# EAGLE design Probe Board 1.0 (EAGLE 9.3.0)

## Sheet 1 of 3: ADC Schematic
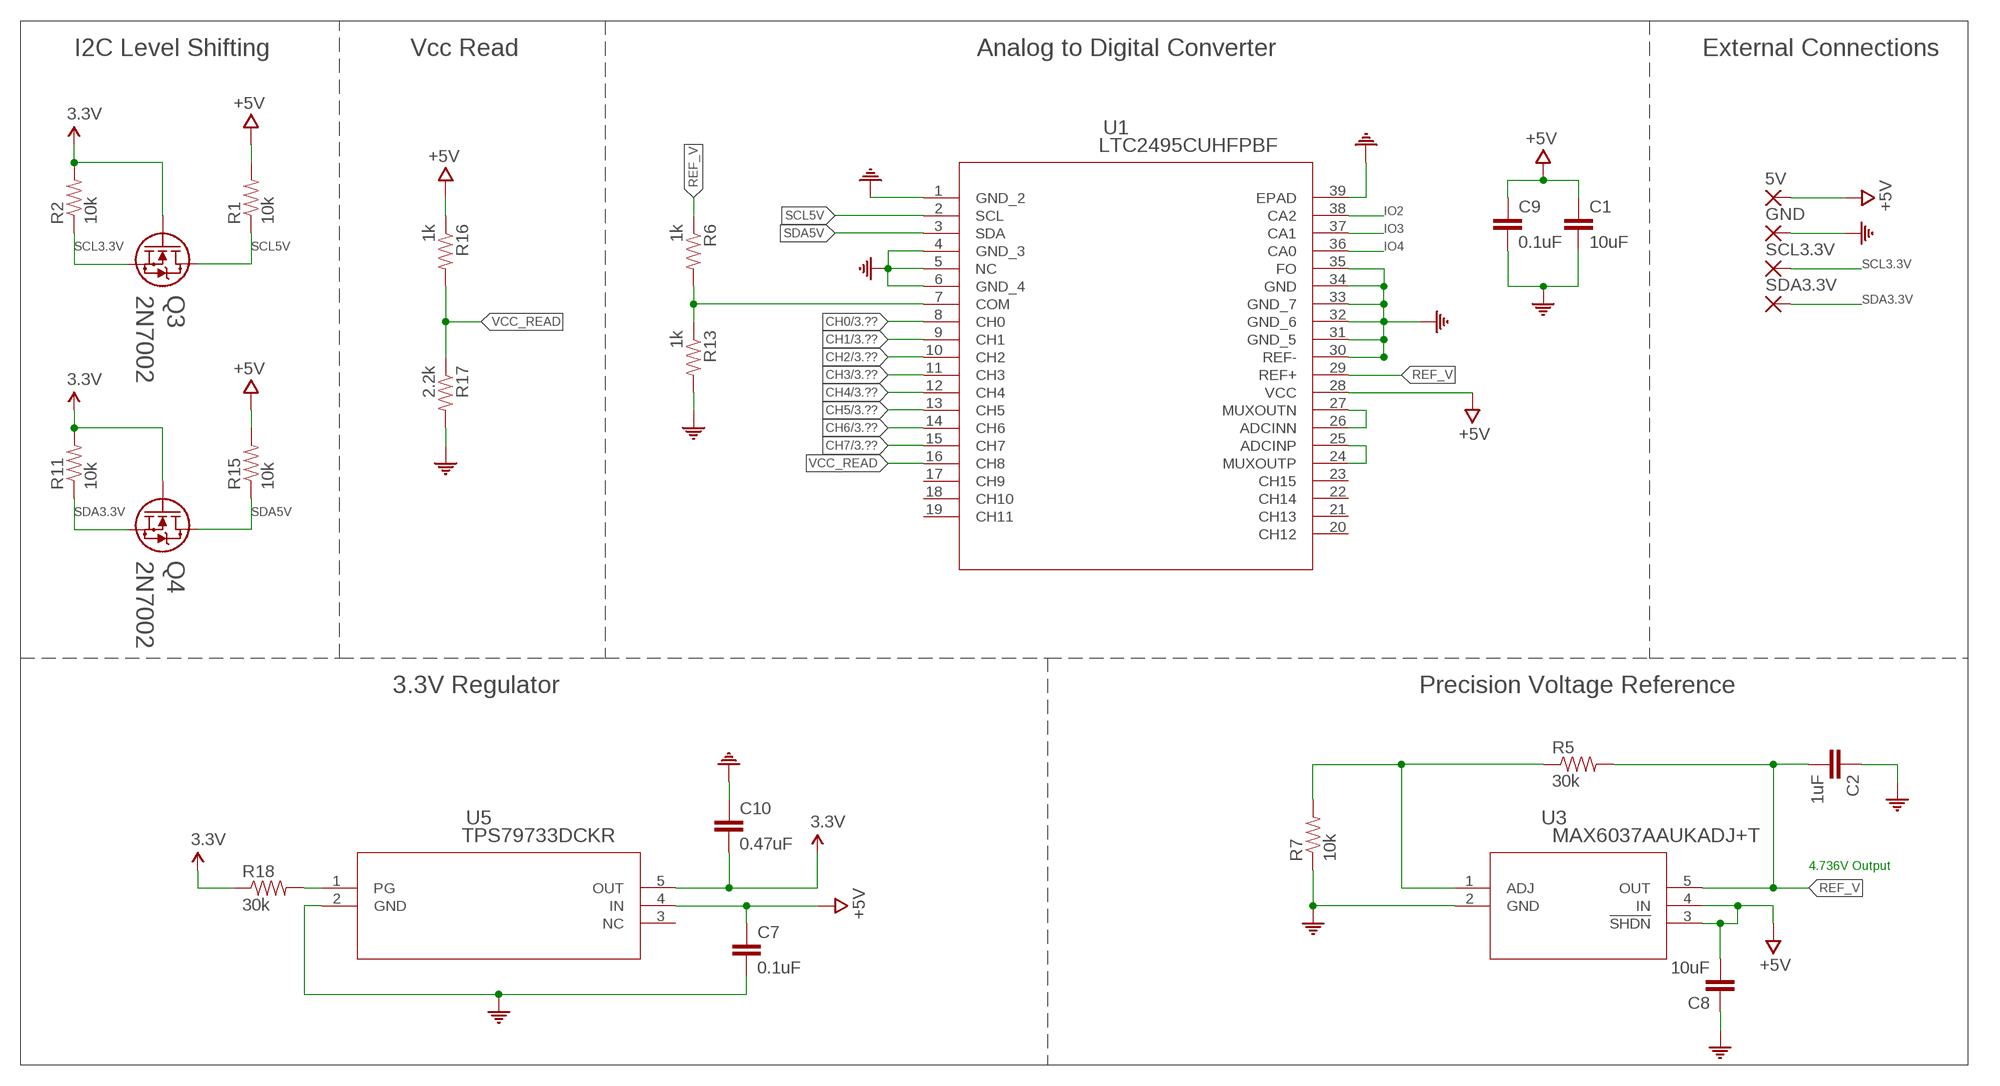
[diagram p0: schematic, sheet 1]

### Parts
5V  1,6/0,9  [1,6/0,9]
C1  10uF  CAP0603-CAP  [0603-CAP]
C2  1uF  CAP0603-CAP  [0603-CAP]
C7  0.1uF  CAP0603-CAP  [0603-CAP]
C8  10uF  CAP0603-CAP  [0603-CAP]
C9  0.1uF  CAP0603-CAP  [0603-CAP]
C10  0.47uF  CAP0603-CAP  [0603-CAP]
GND  1,6/0,9  [1,6/0,9]
Q3  2N7002  [SOT23-3L]
Q4  2N7002  [SOT23-3L]
R1  10k  RESISTOR0603-RES  [0603-RES]
R2  10k  RESISTOR0603-RES  [0603-RES]
R5  30k  RESISTOR0603-RES  [0603-RES]
R6  1k  RESISTOR0603-RES  [0603-RES]
R7  10k  RESISTOR0603-RES  [0603-RES]
R11  10k  RESISTOR0603-RES  [0603-RES]
R13  1k  RESISTOR0603-RES  [0603-RES]
R15  10k  RESISTOR0603-RES  [0603-RES]
R16  1k  RESISTOR0603-RES  [0603-RES]
R17  2.2k  RESISTOR0603-RES  [0603-RES]
R18  30k  RESISTOR0603-RES  [0603-RES]
SCL3.3V  1,6/0,9  [1,6/0,9]
SDA3.3V  1,6/0,9  [1,6/0,9]
U1  LTC2495CUHFPBF  [QFN-38_UHF]
U3  MAX6037AAUKADJ+T  [21-0057F]
U5  TPS79733DCKR  [DCK5]

### Nets
3.3V: C10.2 Q3.1 Q4.1 R2.2 R11.2 R18.1 U5.5(OUT)
+5V: 5V.1(P) C1.1 C7.1 C8.2 C9.1 R1.2 R15.2 R16.1 U1.28(VCC) U3.3(!SHDN) U3.4(IN) U5.4(IN) ; also sheet 2,3
CH0: U1.8(CH0) ; also sheet 3
CH1: U1.9(CH1) ; also sheet 3
CH2: U1.10(CH2) ; also sheet 3
CH3: U1.11(CH3) ; also sheet 3
CH4: U1.12(CH4) ; also sheet 3
CH5: U1.13(CH5) ; also sheet 3
CH6: U1.14(CH6) ; also sheet 3
CH7: U1.15(CH7) ; also sheet 3
COM: C1.2 C2.1 C7.2 C8.1 C9.2 C10.1 GND.1(P) R7.1 R13.2 R17.2 U1.1(GND_2) U1.4(GND_3) U1.5(NC) U1.6(GND_4) U1.30(REF-) U1.31(GND_5) U1.32(GND_6) U1.33(GND_7) U1.34(GND) U1.35(FO) U1.39(EPAD) U3.2(GND) U5.2(GND) ; also sheet 2,3
IO2: U1.38(CA2) ; also sheet 2
IO3: U1.37(CA1) ; also sheet 2
IO4: U1.36(CA0) ; also sheet 2
N$2: U1.26(ADCINN) U1.27(MUXOUTN)
N$3: U1.24(MUXOUTP) U1.25(ADCINP)
N$5: R6.2 R13.1 U1.7(COM)
N$6: R5.1 R7.2 U3.1(ADJ)
N$9: R18.2 U5.1(PG)
REF_V: C2.2 R5.2 R6.1 U1.29(REF+) U3.5(OUT)
SCL3.3V: Q3.2 R2.1 SCL3.3V.1(P)
SCL5V: Q3.5 R1.1 U1.2(SCL)
SDA3.3V: Q4.2 R11.1 SDA3.3V.1(P)
SDA5V: Q4.5 R15.1 U1.3(SDA)
VCC_READ: R16.2 R17.1 U1.16(CH8)
Unconnected: U1.17(CH9) U1.18(CH10) U1.19(CH11) U1.20(CH12) U1.21(CH13) U1.22(CH14) U1.23(CH15) U5.3(NC)

### Notes on the sheet
- I2C Level Shifting | Vcc Read | Analog to Digital Converter | External Connections
- 3.3V Regulator | Precision Voltage Reference
- 4.736V Output

## Sheet 2 of 3: Arduino Schematic
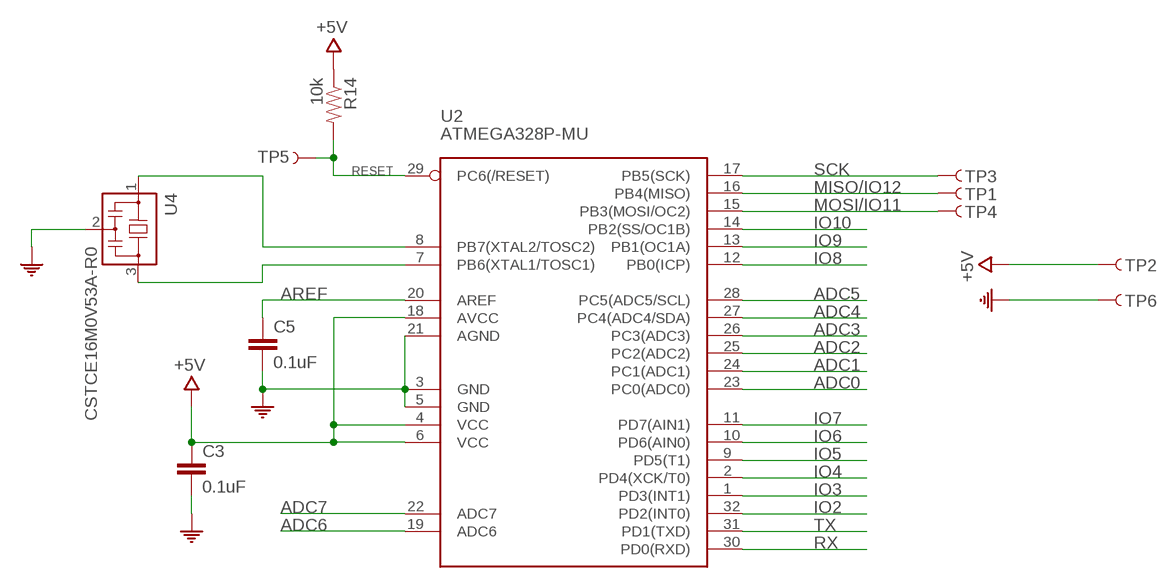
[diagram p1: schematic, sheet 2]

### Parts
C3  0.1uF  CAP0603-CAP  [0603-CAP]
C5  0.1uF  CAP0603-CAP  [0603-CAP]
R14  10k  RESISTOR0603-RES  [0603-RES]
TP1  TEST-POINT3  [PAD.03X.03]
TP2  TEST-POINT3  [PAD.03X.03]
TP3  TEST-POINT3  [PAD.03X.03]
TP4  TEST-POINT3  [PAD.03X.03]
TP5  TEST-POINT3  [PAD.03X.03]
TP6  TEST-POINT3  [PAD.03X.03]
U2  ATMEGA328P-MU  ATMEGAXX8-MUR  [MLF32]
U4  CSTCE16M0V53A-R0  [CSTCE_V]

### Nets
+5V: C3.1 R14.1 TP2.P$1 U2.4(VCC) U2.6(VCC) U2.18(AVCC) ; also sheet 1,3
ADC0: U2.23(PC0(ADC0))
ADC1: U2.24(PC1(ADC1))
ADC2: U2.25(PC2(ADC2))
ADC3: U2.26(PC3(ADC3))
ADC4: U2.27(PC4(ADC4/SDA))
ADC5: U2.28(PC5(ADC5/SCL))
ADC6: U2.19(ADC6)
ADC7: U2.22(ADC7)
AREF: C5.1 U2.20(AREF)
COM: C3.2 C5.2 TP6.P$1 U2.3(GND) U2.5(GND) U2.21(AGND) U4.2 ; also sheet 1,3
IO2: U2.32(PD2(INT0)) ; also sheet 1
IO3: U2.1(PD3(INT1)) ; also sheet 1
IO4: U2.2(PD4(XCK/T0)) ; also sheet 1
IO5: U2.9(PD5(T1))
IO6: U2.10(PD6(AIN0))
IO7: U2.11(PD7(AIN1))
IO8: U2.12(PB0(ICP))
IO9: U2.13(PB1(OC1A))
IO10: U2.14(PB2(SS/OC1B))
MISO/IO12: TP1.P$1 U2.16(PB4(MISO))
MOSI/IO11: TP4.P$1 U2.15(PB3(MOSI/OC2))
N$1: U2.8(PB7(XTAL2/TOSC2)) U4.1
N$7: U2.7(PB6(XTAL1/TOSC1)) U4.3
RESET: R14.2 TP5.P$1 U2.29(PC6(/RESET))
RX: U2.30(PD0(RXD))
SCK: TP3.P$1 U2.17(PB5(SCK))
TX: U2.31(PD1(TXD))

## Sheet 3 of 3: Thermistor Connections
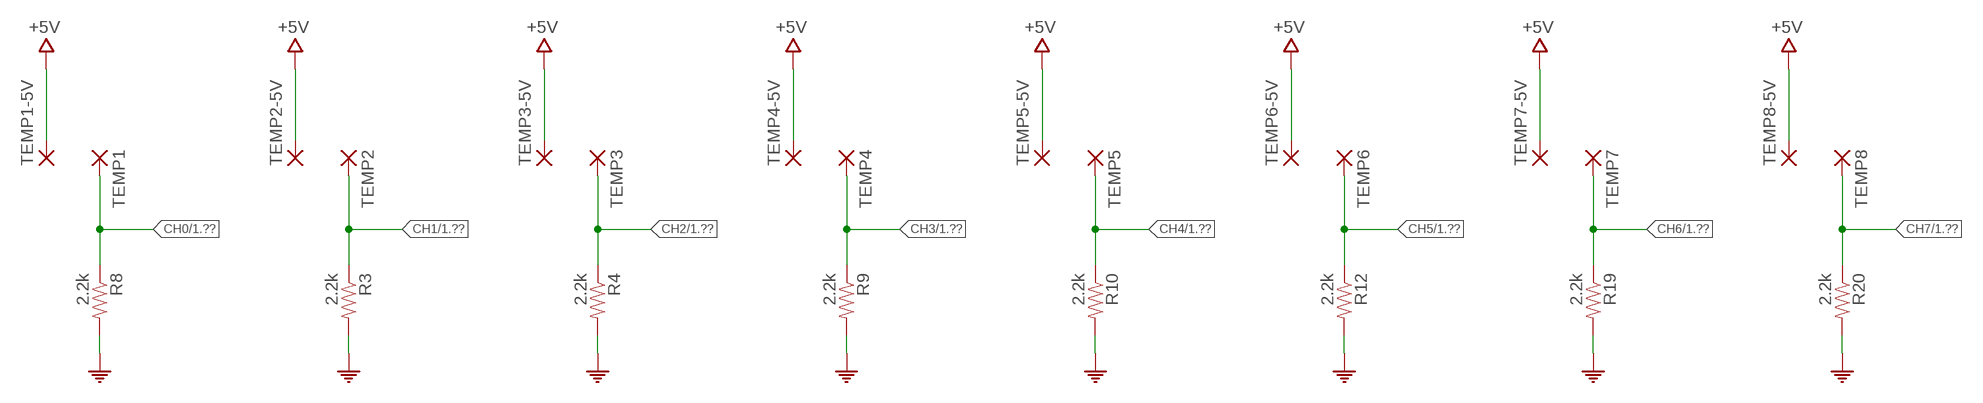
[diagram p2: schematic, sheet 3]

### Parts
R3  2.2k  RESISTOR0603-RES  [0603-RES]
R4  2.2k  RESISTOR0603-RES  [0603-RES]
R8  2.2k  RESISTOR0603-RES  [0603-RES]
R9  2.2k  RESISTOR0603-RES  [0603-RES]
R10  2.2k  RESISTOR0603-RES  [0603-RES]
R12  2.2k  RESISTOR0603-RES  [0603-RES]
R19  2.2k  RESISTOR0603-RES  [0603-RES]
R20  2.2k  RESISTOR0603-RES  [0603-RES]
TEMP1  1,6/0,9  [1,6/0,9]
TEMP1-5V  1,6/0,9  [1,6/0,9]
TEMP2  1,6/0,9  [1,6/0,9]
TEMP2-5V  1,6/0,9  [1,6/0,9]
TEMP3  1,6/0,9  [1,6/0,9]
TEMP3-5V  1,6/0,9  [1,6/0,9]
TEMP4  1,6/0,9  [1,6/0,9]
TEMP4-5V  1,6/0,9  [1,6/0,9]
TEMP5  1,6/0,9  [1,6/0,9]
TEMP5-5V  1,6/0,9  [1,6/0,9]
TEMP6  1,6/0,9  [1,6/0,9]
TEMP6-5V  1,6/0,9  [1,6/0,9]
TEMP7  1,6/0,9  [1,6/0,9]
TEMP7-5V  1,6/0,9  [1,6/0,9]
TEMP8  1,6/0,9  [1,6/0,9]
TEMP8-5V  1,6/0,9  [1,6/0,9]

### Nets
+5V: TEMP1-5V.1(P) TEMP2-5V.1(P) TEMP3-5V.1(P) TEMP4-5V.1(P) TEMP5-5V.1(P) TEMP6-5V.1(P) TEMP7-5V.1(P) TEMP8-5V.1(P) ; also sheet 1,2
CH0: R8.1 TEMP1.1(P) ; also sheet 1
CH1: R3.1 TEMP2.1(P) ; also sheet 1
CH2: R4.1 TEMP3.1(P) ; also sheet 1
CH3: R9.1 TEMP4.1(P) ; also sheet 1
CH4: R10.1 TEMP5.1(P) ; also sheet 1
CH5: R12.1 TEMP6.1(P) ; also sheet 1
CH6: R19.1 TEMP7.1(P) ; also sheet 1
CH7: R20.1 TEMP8.1(P) ; also sheet 1
COM: R3.2 R4.2 R8.2 R9.2 R10.2 R12.2 R19.2 R20.2 ; also sheet 1,2

## Library data of the parts
5V GND SCL3.3V SDA3.3V TEMP1 TEMP1-5V TEMP2 TEMP2-5V TEMP3 TEMP3-5V TEMP4 TEMP4-5V TEMP5 TEMP5-5V TEMP6 TEMP6-5V TEMP7 TEMP7-5V TEMP8 TEMP8-5V = wirepad:1,6/0,9: THROUGH-HOLE PAD
C1 C8 = SparkFun:CAP: Capacitor Standard 0603 ceramic capacitor, and 0.1" leaded capacitor.; DIGIKEY_PART_NUMBER: 445-9104-6-ND; MANUFACTURER: TDK Corporation; MANUFACTURER_PART_NUMBER: C1608X7S0J106M080AC; PRICE: 0.18328
C2 = SparkFun:CAP: Capacitor Standard 0603 ceramic capacitor, and 0.1" leaded capacitor.; DIGIKEY_PART_NUMBER: 1276-1184-6-ND; MANUFACTURER: Samsung Electro-Mechanics; MANUFACTURER_PART_NUMBER: CL10B105KA8NNNC; PRICE: 0.01719
C3 C5 C7 C9 = SparkFun:CAP: Capacitor Standard 0603 ceramic capacitor, and 0.1" leaded capacitor.; DIGIKEY_PART_NUMBER: 478-7939-2-ND; MANUFACTURER: AVX Corporation; MANUFACTURER_PART_NUMBER: 0603ZC104KAT2A; PRICE: 0.08325
C10 = SparkFun:CAP: Capacitor Standard 0603 ceramic capacitor, and 0.1" leaded capacitor.; DIGIKEY_PART_NUMBER: 478-10367-1-ND; MANUFACTURER: AVX Corporation; MANUFACTURER_PART_NUMBER: 0603ZC474KAT2A; PRICE: 0.02904
Q3 = 2N7002(2):2N7002; DIGIKEY_PART_NUMBER: 2N7002NCT-ND; MANUFACTURER: ON Semiconductor; MANUFACTURER_PART_NUMBER: 2N7002; PRICE: 0.06193; VENDOR: ON Semiconductor
Q4 = 2N7002(2):2N7002; DIGIKEY_PART_NUMBER: 2N7002NCT-ND; MANUFACTURER: ON Semiconductor; MANUFACTURER_PART_NUMBER: 2N7002; PRICE: 0.06193; VENDOR: STMicroelectronics
R1 R2 R7 R11 R14 R15 = SparkFun:RESISTOR: Resistor Basic schematic elements and footprints for 0603, 1206, and PTH resistors.; DIGIKEY_PART_NUMBER: P10KGTR-ND; MANUFACTURER: Panasonic Electronic Components; MANUFACTURER_PART_NUMBER: ERJ-3GEYJ103V; PRICE: 0.00494
R3 R4 R8-R10 R12 R17 R19 R20 = SparkFun:RESISTOR: Resistor Basic schematic elements and footprints for 0603, 1206, and PTH resistors.; DIGIKEY_PART_NUMBER: P2.2KDBTR-ND; MANUFACTURER: Panasonic Electronic Components; MANUFACTURER_PART_NUMBER: ERA-3AEB222V; PRICE: 0.03717
R5 R18 = SparkFun:RESISTOR: Resistor Basic schematic elements and footprints for 0603, 1206, and PTH resistors.; DIGIKEY_PART_NUMBER: P30KGDKR-ND; MANUFACTURER: Panasonic Electronic Components; MANUFACTURER_PART_NUMBER: ERJ-3GEYJ303V; PRICE: 0.00758
R6 R13 R16 = SparkFun:RESISTOR: Resistor Basic schematic elements and footprints for 0603, 1206, and PTH resistors.; DIGIKEY_PART_NUMBER: P1.0KDBDKR-ND; MANUFACTURER: Panasonic Electronic Components; MANUFACTURER_PART_NUMBER: ERA-3AEB102V; PRICE: 0.04906
TP1-TP6 = SparkFun-Passives:TEST-POINT: Bare copper test points for troubleshooting or ICT
U1 = LTC2495:LTC2495CUHFPBF; DIGIKEY_PART_NUMBER: LTC2495IUHF#PBF-ND; MANUFACTURER: Linear Technology/Analog Devices; MANUFACTURER_PART_NUMBER: LTC2495CUHF#PBF; PRICE: 5.11040; VENDOR: Linear Technology
U2 = Smartprj:ATMEGAXX8: MICROCONTROLLER 8 Kbytes FLASH 1 kbytes SRAM 512 bytes EEPROM USART 6-channel 10 bit ADC 2-channel 8 bit ADC Source: avr.lbr; DIGIKEY_PART_NUMBER: ATMEGA328P-MU-ND; MANUFACTURER: Microchip Technology; MANUFACTURER_PART_NUMBER: ATMEGA328P-MU; PRICE: 1.95040
U3 = MAX6037AAUKADJ:MAX6037AAUKADJ+T; DIGIKEY_PART_NUMBER: MAX6037AAUK33+TCT-ND; MANUFACTURER: Maxim Integrated; MANUFACTURER_PART_NUMBER: MAX6037AAUK33+T; PRICE: 2.59488; VENDOR: Maxim Integrated Products
U4 = Murata Resonator:CSTCE16M0V53A-R0; DIGIKEY_PART_NUMBER: 490-1198-1-ND; MANUFACTURER: Murata Electronics North America; MANUFACTURER_PART_NUMBER: CSTCE16M0V53-R0; PRICE: 0.26858; VENDOR: Murata
U5 = TPS79733:TPS79733DCKR; DIGIKEY_PART_NUMBER: 296-11990-6-ND; MANUFACTURER: Texas Instruments; MANUFACTURER_PART_NUMBER: TPS79733DCKR; PRICE: 0.46196; VENDOR: Texas Instruments

## Net classes
0 default: width 0.203 mm

## Board
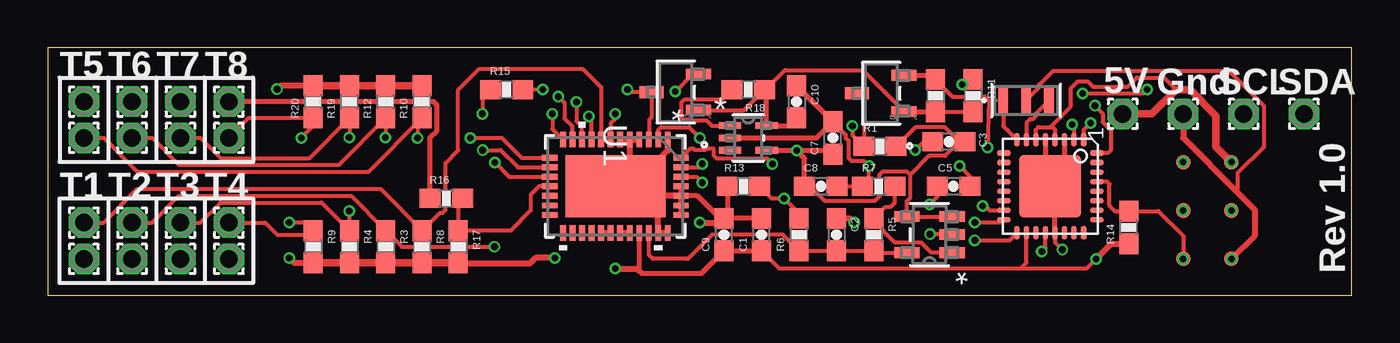
[diagram p3: board, top side]
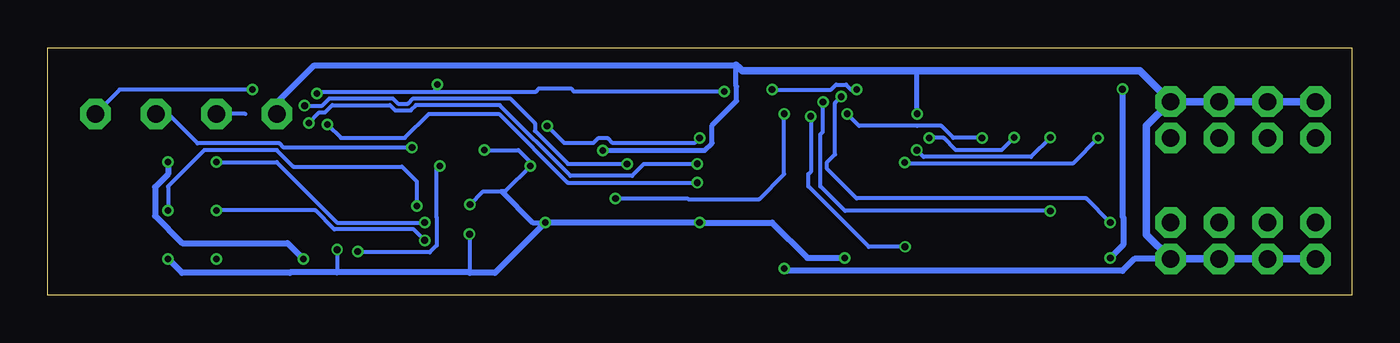
[diagram p4: board, bottom side, seen from below]

Size 68.56 x 13.01 mm. Coordinates in mm from the lower left corner, seen from the top.
Outline: 0,0 68.56,0 68.56,13.01 0,13.01 0,0
Copper layers (1*16): Top 0.035559375mm / dielectric 1.6mm / Bottom 0.035559375mm
Design rules "oshpark-2layer": minimum track width 6mil, minimum drill 10mil, track to track 6mil, track to pad 6mil, pad to pad 6mil, via to via 6mil, smd to smd 6mil, copper to edge 15mil, drill to drill 6mil, minimum pad ring 5mil, minimum via ring 5mil, stop-mask expansion 2.5mil, vias tented up to drill 0mil, thermal gap 10mil

### Footprints (pad centres in the part's own frame; a part is rotated, then mirrored left to right if it is on the bottom)
1,6/0,9 = drill 0.914 pad 1.6 octagon: 1 0,0
0603-CAP = smd 1.1 x 1: 1 -0.85,0; 2 0.85,0
SOT23-3L = smd 0.559 x 1.321: 1 -0.95,-1.194; 2 0.95,-1.194 | smd 0 x 0 bottom: 3 0,1.194 | smd 0.635 x 1.27: 5 0,1.27
0603-RES = smd 1.1 x 1: 1 -0.85,0; 2 0.85,0
PAD.03X.03 = smd 0.762 x 0.762: P$1 0,0
QFN-38_UHF = smd 0.805 x 0.3: 1 -2.452,2.75; 2 -2.452,2.25; 3 -2.452,1.75; 4 -2.452,1.25; 5 -2.452,0.75; 6 -2.452,0.25; 7 -2.452,-0.25; 8 -2.452,-0.75; 9 -2.452,-1.25; 10 -2.452,-1.75; 11 -2.452,-2.25; 12 -2.452,-2.75; 20 2.452,-2.75; 21 2.452,-2.25; 22 2.452,-1.75; 23 2.452,-1.25; 24 2.452,-0.75; 25 2.452,-0.25; 26 2.452,0.25; 27 2.452,0.75; 28 2.452,1.25; 29 2.452,1.75; 30 2.452,2.25; 31 2.452,2.75 | smd 0.3 x 0.805: 13 -1.5,-3.452; 14 -1,-3.452; 15 -0.5,-3.452; 16 0,-3.452; 17 0.5,-3.452; 18 1,-3.452; 19 1.5,-3.452; 32 1.5,3.452; 33 1,3.452; 34 0.5,3.452; 35 0,3.452; 36 -0.5,3.452; 37 -1,3.452; 38 -1.5,3.452 | smd 3.25 x 5.25: 39 0,0
MLF32 = smd 0.7 x 0.28: 1 -2.45,1.75; 2 -2.45,1.25; 3 -2.45,0.75; 4 -2.45,0.25; 5 -2.45,-0.25; 6 -2.45,-0.75; 7 -2.45,-1.25; 8 -2.45,-1.75; 17 2.45,-1.75; 18 2.45,-1.25; 19 2.45,-0.75; 20 2.45,-0.25; 21 2.45,0.25; 22 2.45,0.75; 23 2.45,1.25; 24 2.45,1.75 | smd 0.28 x 0.7: 9 -1.75,-2.45; 10 -1.25,-2.45; 11 -0.75,-2.45; 12 -0.25,-2.45; 13 0.25,-2.45; 14 0.75,-2.45; 15 1.25,-2.45; 16 1.75,-2.45; 25 1.75,2.45; 26 1.25,2.45; 27 0.75,2.45; 28 0.25,2.45; 29 -0.25,2.45; 30 -0.75,2.45; 31 -1.25,2.45; 32 -1.75,2.45 | smd 3.254 x 3.254: 33 0,0
21-0057F = smd 1.321 x 0.559: 1 -1.194,0.95; 2 -1.194,0; 3 -1.194,-0.95; 4 1.194,-0.95; 5 1.194,0.95
CSTCE_V = smd 0.508 x 1.448: 1 -1.2,0; 2 0,0; 3 1.2,0
DCK5 = smd 1.168 x 0.356: 1 -0.965,0.65; 2 -0.965,0; 3 -0.965,-0.65; 4 0.965,-0.65; 5 0.965,0.65

### Placement (x,y rotation side)
5V  56.52,9.53 0 top
C1  37.53,3.17 90 top
C2  41.47,3.17 270 top
C3  47.37,8.06 180 top
C5  47.62,5.71 180 top
C7  41.27,8.26 90 top
C8  40.64,5.71 180 top
C9  35.56,3.17 90 top
C10  39.37,10.16 270 top
GND  59.69,9.53 0 top
Q3  43.81,10.6 90 top
Q4  33.02,10.67 90 top
R1  43.75,7.81 0 top
R2  46.67,10.48 270 top
R3  17.78,2.54 270 top
R4  15.88,2.54 270 top
R5  43.43,3.17 270 top
R6  39.5,3.17 90 top
R7  43.69,5.71 0 top
R8  19.68,2.54 270 top
R9  13.97,2.54 270 top
R10  19.68,10.16 90 top
R11  48.64,10.48 270 top
R12  17.78,10.16 90 top
R13  36.58,5.71 180 top
R14  56.83,3.56 90 top
R15  24.13,10.79 180 top
R16  20.95,5.08 0 top
R17  21.59,2.54 270 top
R18  36.83,10.79 180 top
R19  15.88,10.16 90 top
R20  13.97,10.16 90 top
SCL3.3V  62.87,9.53 0 top
SDA3.3V  66.04,9.53 0 top
TEMP1  1.91,3.81 0 top
TEMP1-5V  1.91,1.91 0 top
TEMP2  4.45,3.81 0 top
TEMP2-5V  4.45,1.91 0 top
TEMP3  6.99,3.81 0 top
TEMP3-5V  6.99,1.91 0 top
TEMP4  9.53,3.81 0 top
TEMP4-5V  9.53,1.91 0 top
TEMP5  1.91,8.26 0 top
TEMP5-5V  1.91,10.16 0 top
TEMP6  4.45,8.26 0 top
TEMP6-5V  4.45,10.16 0 top
TEMP7  6.99,8.26 0 top
TEMP7-5V  6.99,10.16 0 top
TEMP8  9.53,8.26 0 top
TEMP8-5V  9.53,10.16 0 top
TP1  59.69,6.99 0 top
TP2  62.23,6.99 0 top
TP3  59.69,4.45 0 top
TP4  62.23,4.45 0 top
TP5  59.69,1.91 0 top
TP6  62.23,1.91 0 top
U1  29.84,5.71 270 top
U2  52.7,5.71 270 top
U3  46.35,3.17 180 top
U4  51.44,10.22 0 top
U5  36.83,8.26 0 top

### Tracks (layer width: path | path; a pad name or v marks a point on that pad's centre or on a via)
3.3V
  Top 0.203: Q4.1 36.6,9.72 R18.1 37.75,10.79 38.77,11.81 42.85,11.81 Q3.1 | R2.2 R11.2
  Top 0.254: C10.2 38.97,8.9 U5.5 37.8,10.68 R18.1 | Q3.1 45.04,9.63 R2.2
+5V  (via drill 0.35)
  Top 0.203: 45.34,6.32 45.34,5.11 45.16,4.93 U3.4 U3.3 | 45.34,6.32 45.19,6.47 43.88,6.47 43.73,6.32 43.73,5.2 43.49,4.96 40.84,4.96 40.08,5.71 C8.2 | R15.2 22.86,10.38 v22.86,9.53 | 44.45,7.66 R1.2 45.61,8.82 47.18,8.82 47.93,8.06 | 51.13,1.39 38.46,1.39 C1.1 | 51.13,1.39 51.45,1.71 U2.18 | v55.12,1.91 54.6,1.39 51.13,1.39 | 59.33,10.79 58.69,11.43 57.25,11.43 56.77,10.95 54.95,10.95 54.67,11.23 54.15,11.23 53.78,10.86 53.78,9.9 52.7,8.83 | U2.6 51.95,8.71 52.07,8.83 52.7,8.83 | 52.7,8.83 52.83,8.83 52.96,8.7 52.95,8.7 U2.4 | 45.34,6.32 46.33,7.31 47.18,7.31 47.93,8.06 | C3.1 47.93,8.06
  Top 0.254: R16.1 20.11,8.29 20.46,8.64 20.46,9.98 20.28,10.16 TEMP8-5V.1 | U1.28 31.09,1.29 31.24,1.14 34.38,1.14 C9.1 C1.1 | 41.08,7.61 C7.1 41.08,7.6 v39.37,7.6 | U5.4 v39.36,7.61 v39.37,7.6 | C8.2 39.79,7.18 v39.37,7.6
  Top 0.305: v29.84,1.39 30.99,1.39 31.09,1.29 | v55.12,1.91 55.92,2.71 R14.1
  Top 0.406: TP2.P$1 61.42,7.8 61.42,9.43 60.05,10.79 59.33,10.79 58.06,9.53 5V.1
  Bottom 0.254: v22.86,9.53 22.86,11.79 | 32.38,12.06 32.38,11.01 32.34,10.97 32.34,10.2 33.63,8.91 33.63,7.98 34.02,7.6 v39.37,7.6
  Bottom 0.305: 32.38,12.06 54.55,12.06 56.52,10.1 5V.1 | TEMP4-5V.1 11.43,1.91 12.06,1.27 29.72,1.27 v29.84,1.39 | TP2.P$1 62.23,6.35 62.91,5.67 62.91,4.16 61.48,2.73 55.94,2.73 v55.12,1.91
  Bottom 0.406: TEMP1-5V.1 TEMP2-5V.1 TEMP3-5V.1 TEMP4-5V.1 10.79,3.17 10.79,8.89 TEMP8-5V.1 | TEMP5-5V.1 TEMP6-5V.1 TEMP7-5V.1 TEMP8-5V.1 | 32.38,12.06 32.03,11.79 22.86,11.79 11.15,11.79 TEMP8-5V.1
  other vias: 62.23,6.99
AREF  (via drill 0.35)
  Top 0.203: v47.94,6.79 48.48,6.25 C5.1 | v52.26,2.29 52.45,2.48 U2.20
  Bottom 0.203: v47.94,6.79 48.13,6.59 48.13,4.1 48.11,4.07 48.11,2.62 48.48,2.25 52.22,2.25 v52.26,2.29
CH0
  Top 0.203: TEMP1.1 2.95,3.81 4.72,5.58 17.5,5.58 R8.1 20.62,4.33 20.76,4.33 20.91,4.47 20.91,6.94 21.59,7.62 21.59,10.79 22.68,11.89 28.12,11.89 29.09,10.91 U1.8
CH1  (via drill 0.35)
  Top 0.203: TEMP2.1 5.49,3.81 6.9,5.22 15.95,5.22 R3.1 18.63,2.54 v23.5,2.54 | U1.9 28.59,9.25 v28.45,9.39
  Bottom 0.203: v23.5,2.54 25.4,2.54 28.57,5.71 28.57,6.35 28.45,6.48 v28.45,9.39
CH2  (via drill 0.35)
  Top 0.203: TEMP3.1 8.03,3.81 9.09,4.86 14.4,4.86 R4.1 15.88,4.4 v15.85,4.42 | 28.07,8.2 28.07,8.19 | 28.07,8.19 U1.10 | v27.8,10.15 27.8,9.14 28.07,8.88 28.07,8.19
  Bottom 0.203: v15.85,4.42 26.65,4.42 27.94,5.71 27.94,8.45 27.81,8.57 27.81,10.14 v27.8,10.15
CH3  (via drill 0.35)
  Top 0.203: TEMP4.1 11.43,3.81 12.06,3.17 13.76,3.17 R9.1 13.55,3.81 v12.7,3.81 | U1.11 27.56,8.2 27.56,8.88 27.17,9.27 27.17,10.1 v26.85,10.42
  Bottom 0.203: v12.7,3.81 13.97,5.08 26.04,5.08 27.58,6.63 27.58,6.99 27.17,7.4 27.17,10.1 v26.85,10.42
CH4  (via drill 0.35)
  Top 0.203: TEMP5.1 2.95,8.26 4.72,6.49 16.86,6.49 R10.1 19.45,9.07 v19.45,8.26 | v26.54,9.53 26.54,8.72 U1.12
  Bottom 0.203: v19.45,8.26 20.95,8.26 21.59,8.89 22.86,8.89 25.9,8.89 v26.54,9.53
CH5  (via drill 0.35)
  Top 0.203: TEMP6.1 5.49,8.26 6.9,6.84 15.31,6.84 R12.1 17.78,8.3 v17.76,8.28 | v22.23,8.26 23.88,8.26 24.92,7.21 U1.13
  Bottom 0.203: v17.76,8.28 18.41,7.62 20.82,7.62 21.46,8.26 v22.23,8.26
CH6  (via drill 0.35)
  Top 0.203: TEMP7.1 8.03,8.26 9.09,7.2 13.77,7.2 R19.1 15.88,8.3 v15.85,8.28 | v22.87,7.61 23.82,7.61 24.72,6.71 U1.14
  Bottom 0.203: v15.85,8.28 16.87,7.26 22.52,7.26 v22.87,7.61
CH7  (via drill 0.35)
  Top 0.203: TEMP8.1 10.58,9.31 R20.1 13.97,8.89 v13.34,8.26 | v23.51,6.97 24.27,6.21 U1.15
  Bottom 0.203: v13.34,8.26 14.68,6.91 23.45,6.91 v23.51,6.97
COM  (via drill 0.35)
  Top 0.203: 41.47,5.69 C8.1 R7.1 43.18,6.06 v43.18,6.78 42.9,7.06 42.25,7.06 42.1,7.21 42.1,8.11 41.95,8.26 41.95,8.43 C7.2 | U3.2 47.52,3.2 v46.38,3.2 | U2.3 53.45,7.8 | 46.77,6.05 46.77,5.86 | U2.21 52.95,2.77 v53.34,2.38 | U4.2 52.13,10.91 52.13,11.05 52.86,11.78 62.1,11.78 63.92,9.96 63.92,7.78 62.55,6.4 62.55,5.4 | C5.2 46.77,5.18 v46.35,4.76 | C3.2 46.05,8.06 v45.61,7.62
  Top 0.254: C1.2 C9.2 | C9.2 35.34,4.03 34.16,5.21 U1.34 | C10.1 C7.2 40.42,8.26 U5.2 | U2.5 52.45,5.66 | 52.45,5.66 52.45,5.65 | U2.3 53.45,5.66 53.46,5.66 | 53.47,5.65 53.46,5.66 | 53.46,5.66 52.96,5.66 | 52.96,5.66 52.45,5.66 | U2.21 52.95,5.65 52.96,5.66 | R13.2 35.73,4.19 C9.2
  Top 0.305: U1.5 U1.4 | U1.6 U1.5 | U1.5 30.59,6.46 | 30.59,6.46 U1.39 30.34,5.21 31.75,5.21 | U1.35 U1.34 | U1.34 U1.33 U1.32 | U1.31 U1.30 32.09,4.87 31.75,5.21 | U1.34 31.75,5.21 | U1.1 32.59,7.58 31.48,6.46 30.59,6.46 | v34.29,3.81 35.34,3.81 C9.2 | v26.67,1.95 25.64,1.95 25.34,1.65 21.63,1.65 R17.2 | 46.77,5.86 C5.2 | C2.1 42.19,4.03 v42.4,3.81 | GND.1 59.69,8.26 62.55,5.4 63.45,4.5 63.45,3.12 TP6.P$1 | R20.2 12.26,11.01 v12.06,10.82 | v12.7,1.95 12.96,1.69 R9.2
  Top 0.406: R9.2 R4.2 R3.2 R8.2 R17.2 | R20.2 R19.2 R12.2 R10.2
  Bottom 0.203: v46.38,3.2 46.38,1.19 46.35,1.17 | v53.34,2.38 53.34,1.19 | 58.16,9.53 GND.1 | v46.35,4.76 45.66,5.46 44.71,5.46 44.5,5.46 v43.18,6.78 43.18,6.99 43.81,7.62 v45.61,7.62
  Bottom 0.254: 44.71,5.46 43.06,3.81 v42.4,3.81
  Bottom 0.305: v42.4,3.81 v34.29,3.81 30.48,3.81 28.62,1.95 v26.67,1.95 | v42.4,3.81 42.55,3.81 | v42.4,3.81 45.05,1.17 46.35,1.17 | TP6.P$1 61.49,1.17 55.84,1.17 55.81,1.19 53.34,1.19 46.38,1.19 | v12.06,10.82 12.06,4.14 12.02,4.09 12.02,2.64 v12.7,1.95
  other vias: 62.23,1.91
IO2  (via drill 0.35)
  Top 0.203: v55.05,9.95 55.46,9.54 55.46,9.09 55.88,8.67 55.88,7.62 55.73,7.46 U2.32 | v38.1,6.9 37.82,7.17 35.17,7.17 35.03,7.32 35.03,7.68 34.61,7.68 34.55,7.62 34.03,7.62 33.97,7.68 33.77,7.68 U1.38
  Bottom 0.203: v55.05,9.95 54.13,9.95 53.74,10.34 50.41,10.34 50.14,10.06 49.61,10.06 49.34,10.34 44.26,10.34 42.94,9.02 42.94,8.63 41.21,6.9 v38.1,6.9
IO3  (via drill 0.35)
  Top 0.203: v54.83,9.04 54.45,8.67 U2.1 | U1.37 34.23,6.71 v34.41,6.9
  Bottom 0.203: v34.41,6.9 37.2,6.9 37.84,6.26 41.08,6.26 44.8,9.98 49.19,9.98 49.47,9.71 50.28,9.71 50.56,9.98 53.59,9.98 53.98,9.6 54.28,9.6 v54.83,9.04
IO4  (via drill 0.35)
  Top 0.203: U1.36 34.11,6.21 v34.42,5.91 | v53.85,8.96 53.95,8.86 U2.2
  Bottom 0.203: v53.85,8.96 53.14,8.26 49.79,8.26 48.52,9.53 44.84,9.53 41.22,5.91 v34.42,5.91
MISO/IO12  (via drill 0.35)
  Top 0.203: U2.16 50.1,3.81 v48.74,3.81
  Bottom 0.203: TP1.P$1 56.52,6.99 53.34,3.81 v48.74,3.81
  other vias: 59.69,6.99
MOSI/IO11  (via drill 0.35)
  Top 0.203: v49.15,4.68 49.29,4.68 49.53,4.45 50.23,4.45 U2.15
  Bottom 0.203: TP4.P$1 62.23,5.71 60.33,7.62 56.52,7.62 55.64,6.75 49.93,6.75 49.15,5.97 v49.15,4.68
  other vias: 62.23,4.45
N$1
  Top 0.203: U4.1 50.23,8.88 50.48,8.64 U2.8
N$2
  Top 0.305: U1.26 U1.27
N$3
  Top 0.305: U1.24 U1.25
N$5  (via drill 0.35)
  Top 0.203: 39.12,4.03 R6.2 39.5,4.29 v38.71,5.08 38.06,5.08 R13.1 | v29.84,9.53 29.84,9.27 29.59,9.02 29.59,9.01 U1.7
  Bottom 0.203: v29.84,9.53 29.84,6.35 31.15,5.04 34.89,5.04 34.93,5.08 v38.71,5.08
N$6
  Top 0.203: U3.1 46.46,2.23 45.93,2.76 44.55,2.76 43.43,3.87 R5.1 44.04,4.64 44.32,4.64 44.54,4.85 R7.2
N$7
  Top 0.203: U4.3 51.94,9.53 51.94,9.39 51.79,9.25 51.66,9.25 51.45,9.04 U2.7
N$9
  Top 0.203: 35.87,10.68 R18.2 35.44,10.25 33.45,10.25 33.3,10.1 33.3,9.33 33.45,9.19 34.63,9.19 34.92,8.89 35.85,8.89 U5.1
REF_V
  Top 0.203: U1.29 31.62,3.23 31.62,2.1 31.81,1.91 33.66,1.91 34.92,3.17 38.65,3.17 R6.1 C2.2 R5.2 43.53,2.23 U3.5
RESET  (via drill 0.35)
  Top 0.203: R14.2 56.11,4.41 55.82,4.7 55.81,4.7 55.81,5.85 55.69,5.97 55.69,5.96 U2.29 | 57.19,4.41 R14.2 | R14.2 58.4,4.41 59.69,3.11 TP5.P$1
  other vias: 59.69,1.91
SCK  (via drill 0.35)
  Top 0.203: v48.74,2.88 50.57,2.88 U2.17
  Bottom 0.203: v48.74,2.88 49.31,3.45 53.49,3.45 54.48,4.45 TP3.P$1
  other vias: 59.69,4.45
SCL3.3V  (via drill 0.35)
  Top 0.203: v49.4,7.75 49.47,10.21 49.25,10.43 47.57,10.43 R2.1
  Top 0.254: Q3.2 46.45,11.55 R2.1
  Bottom 0.203: v49.4,7.75 56.14,7.75 56.37,7.98 60.68,7.98 62.23,9.53 SCL3.3V.1
SCL5V  (via drill 0.35)
  Top 0.203: U1.2 32.09,8.66 32.26,8.82 33.72,8.82 v34.29,8.26 | Q3.5 42.9,10.25 R1.1 42.31,8.41 v42.31,8.89
  Bottom 0.203: v34.29,8.26 34.57,7.98 38.86,7.98 39.11,8.23 39.63,8.23 39.88,7.98 41.39,7.98 v42.31,8.89
SDA3.3V  (via drill 0.35)
  Top 0.203: Q4.2 33.92,11.62 v33,10.7 | v54.41,10.59 57.58,10.59 v57.78,10.79 | R11.1 48.59,11.38 48.27,11.06 v48.07,11.06
  Bottom 0.203: v33,10.7 40.89,10.7 41.05,10.86 42.73,10.86 42.89,10.7 48.26,10.7 | v57.78,10.79 64.77,10.79 SDA3.3V.1 | v54.41,10.59 54.31,10.7 48.26,10.7 | v48.07,11.06 48.07,10.89 48.26,10.7
SDA5V  (via drill 0.35)
  Top 0.203: U1.3 31.62,8.2 31.62,9.21 31.75,9.34 Q4.5 30.61,10.67 v30.48,10.79 | v26.04,10.79 R15.1
  Bottom 0.203: v26.04,10.79 26.33,10.79 26.59,11.05 27.11,11.05 27.37,10.79 v30.48,10.79
VCC_READ
  Top 0.203: R16.2 21.59,4.87 R17.1 24.34,3.39 25.4,4.45 25.4,5.27 25.84,5.71 U1.16

### Text on the board
tPlace: T5 | T5 | T6 | T7 | T8 | 5V | Gnd | Gnd | SCL | SDA | T1 | T1 | T2 | T3 | T4 | Rev 1.0